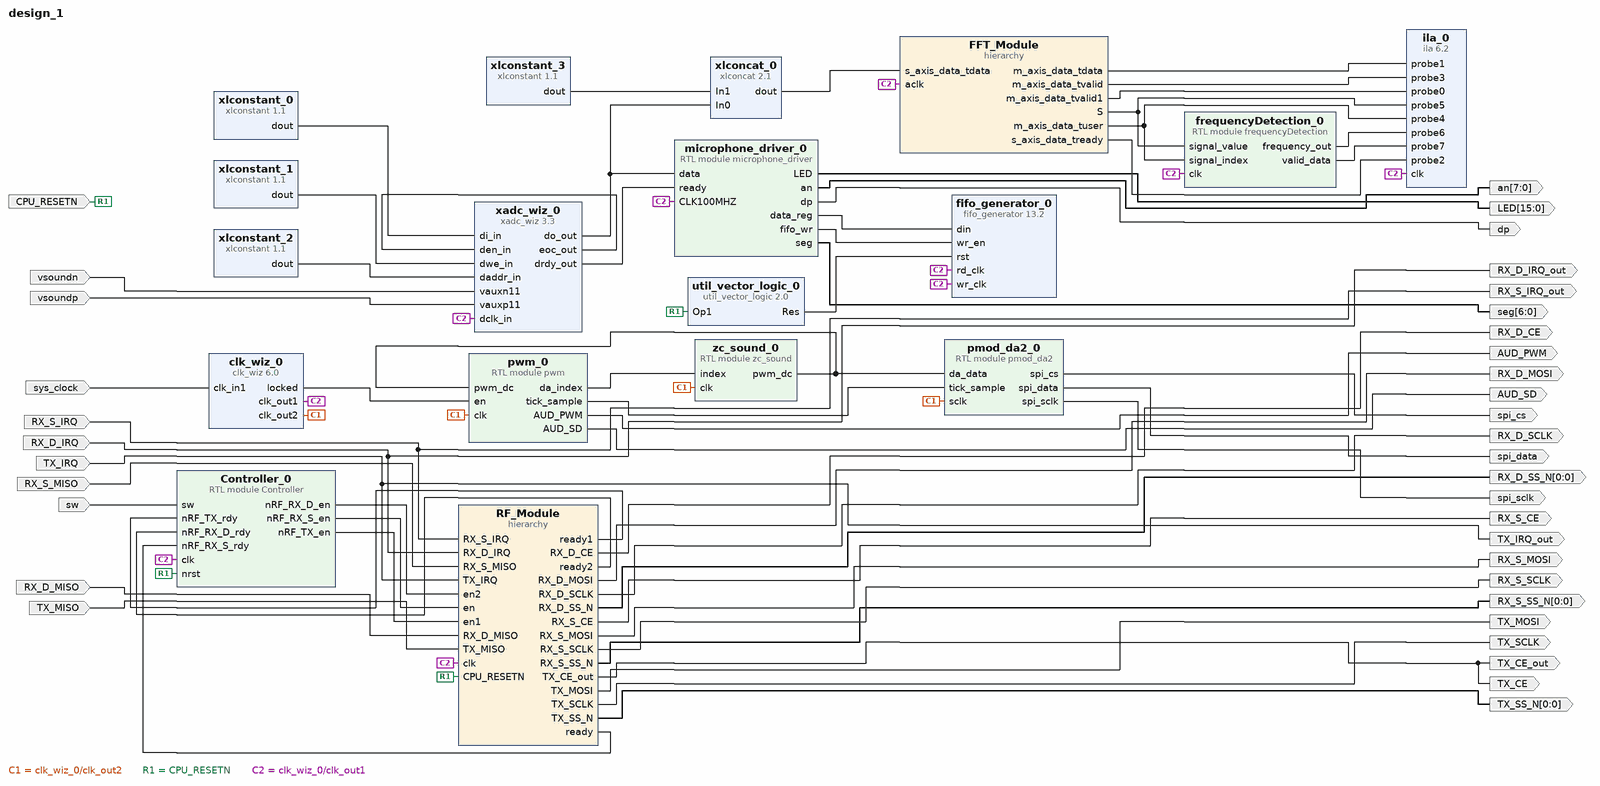
[diagram p0: block diagram of the top level]
# Vivado block design design_1, xc7a100tcsg324-1, Vivado 2022.1
create_bd_design design_1

create_bd_port -dir O TX_CE
create_bd_port -dir I TX_MISO
create_bd_port -dir O TX_MOSI
create_bd_port -dir O TX_SCLK
create_bd_port -dir O -from 0 -to 0 TX_SS_N
create_bd_port -dir I -type intr TX_IRQ
create_bd_port -dir I -type rst CPU_RESETN
create_bd_port -dir O RX_S_CE
create_bd_port -dir I -type intr RX_S_IRQ
create_bd_port -dir I RX_S_MISO
create_bd_port -dir O RX_S_MOSI
create_bd_port -dir O RX_S_SCLK
create_bd_port -dir O -from 0 -to 0 RX_S_SS_N
create_bd_port -dir O RX_D_CE
create_bd_port -dir I -type intr RX_D_IRQ
create_bd_port -dir I RX_D_MISO
create_bd_port -dir O RX_D_MOSI
create_bd_port -dir O RX_D_SCLK
create_bd_port -dir O -from 0 -to 0 RX_D_SS_N
create_bd_port -dir O TX_IRQ_out
create_bd_port -dir O RX_S_IRQ_out
create_bd_port -dir O RX_D_IRQ_out
create_bd_port -dir O TX_CE_out
create_bd_port -dir O AUD_SD
create_bd_port -dir O AUD_PWM
create_bd_port -dir I -type clk sys_clock
set_property -dict {CONFIG.FREQ_HZ 100000000 CONFIG.PHASE 0.000} [get_bd_ports sys_clock]
create_bd_port -dir I vsoundp
create_bd_port -dir O -from 15 -to 0 LED
create_bd_port -dir O -from 7 -to 0 an
create_bd_port -dir O dp
create_bd_port -dir O -from 6 -to 0 seg
create_bd_port -dir O spi_cs
create_bd_port -dir O spi_data
create_bd_port -dir O spi_sclk
create_bd_port -dir I sw
create_bd_port -dir I vsoundn

create_bd_cell -type ip -vlnv xilinx.com:ip:clk_wiz:6.0 clk_wiz_0
set_property -dict [list \
  CONFIG.CLKOUT1_JITTER 130.958 \
  CONFIG.CLKOUT1_PHASE_ERROR 98.575 \
  CONFIG.CLKOUT1_REQUESTED_OUT_FREQ 100.000 \
  CONFIG.CLKOUT2_JITTER 183.243 \
  CONFIG.CLKOUT2_PHASE_ERROR 98.575 \
  CONFIG.CLKOUT2_REQUESTED_OUT_FREQ 20.000 \
  CONFIG.CLKOUT2_USED true \
  CONFIG.CLKOUT3_JITTER 130.958 \
  CONFIG.CLKOUT3_PHASE_ERROR 98.575 \
  CONFIG.CLKOUT3_REQUESTED_OUT_FREQ 25.000 \
  CONFIG.CLKOUT3_USED false \
  CONFIG.MMCM_CLKFBOUT_MULT_F 10.000 \
  CONFIG.MMCM_CLKOUT0_DIVIDE_F 10.000 \
  CONFIG.MMCM_CLKOUT1_DIVIDE 50 \
  CONFIG.MMCM_CLKOUT2_DIVIDE 1 \
  CONFIG.MMCM_DIVCLK_DIVIDE 1 \
  CONFIG.NUM_OUT_CLKS 2 \
  CONFIG.USE_RESET false \
] [get_bd_cells clk_wiz_0]
create_bd_cell -type ip -vlnv xilinx.com:ip:xadc_wiz:3.3 xadc_wiz_0
set_property -dict [list \
  CONFIG.ADC_CONVERSION_RATE 200 \
  CONFIG.ADC_OFFSET_AND_GAIN_CALIBRATION false \
  CONFIG.ADC_OFFSET_CALIBRATION false \
  CONFIG.CHANNEL_AVERAGING None \
  CONFIG.CHANNEL_ENABLE_VAUXP11_VAUXN11 true \
  CONFIG.CHANNEL_ENABLE_VP_VN true \
  CONFIG.CHANNEL_ENABLE_VREFP false \
  CONFIG.DCLK_FREQUENCY 100 \
  CONFIG.ENABLE_CALIBRATION_AVERAGING false \
  CONFIG.ENABLE_RESET false \
  CONFIG.EXTERNAL_MUX_CHANNEL VP_VN \
  CONFIG.INTERFACE_SELECTION ENABLE_DRP \
  CONFIG.OT_ALARM false \
  CONFIG.SENSOR_OFFSET_AND_GAIN_CALIBRATION false \
  CONFIG.SENSOR_OFFSET_CALIBRATION false \
  CONFIG.SEQUENCER_MODE Continuous \
  CONFIG.SINGLE_CHANNEL_SELECTION TEMPERATURE \
  CONFIG.USER_TEMP_ALARM false \
  CONFIG.VCCAUX_ALARM false \
  CONFIG.VCCINT_ALARM false \
  CONFIG.XADC_STARUP_SELECTION channel_sequencer \
] [get_bd_cells xadc_wiz_0]
create_bd_cell -type ip -vlnv xilinx.com:ip:xlconstant:1.1 xlconstant_0
set_property -dict {CONFIG.CONST_VAL 0 CONFIG.CONST_WIDTH 16} [get_bd_cells xlconstant_0]
create_bd_cell -type ip -vlnv xilinx.com:ip:xlconstant:1.1 xlconstant_1
set_property -dict {CONFIG.CONST_VAL 0} [get_bd_cells xlconstant_1]
create_bd_cell -type module -reference zc_sound zc_sound_0
create_bd_cell -type module -reference pwm pwm_0
create_bd_cell -type ip -vlnv xilinx.com:ip:fifo_generator:13.2 fifo_generator_0
set_property -dict [list \
  CONFIG.Fifo_Implementation Independent_Clocks_Builtin_FIFO \
  CONFIG.Input_Data_Width 12 \
  CONFIG.Input_Depth 512 \
  CONFIG.Read_Clock_Frequency 20 \
  CONFIG.Write_Clock_Frequency 100 \
] [get_bd_cells fifo_generator_0]
create_bd_cell -type ip -vlnv xilinx.com:ip:util_vector_logic:2.0 util_vector_logic_0
set_property -dict {CONFIG.C_OPERATION not CONFIG.C_SIZE 1} [get_bd_cells util_vector_logic_0]
create_bd_cell -type ip -vlnv xilinx.com:ip:xlconstant:1.1 xlconstant_2
set_property -dict {CONFIG.CONST_VAL 0x1B CONFIG.CONST_WIDTH 7} [get_bd_cells xlconstant_2]
create_bd_cell -type module -reference Controller Controller_0
create_bd_cell -type module -reference pmod_da2 pmod_da2_0
create_bd_cell -type ip -vlnv xilinx.com:ip:ila:6.2 ila_0
set_property -dict [list \
  CONFIG.C_DATA_DEPTH 8192 \
  CONFIG.C_ENABLE_ILA_AXI_MON false \
  CONFIG.C_MONITOR_TYPE Native \
  CONFIG.C_NUM_OF_PROBES 8 \
  CONFIG.C_PROBE1_TYPE 1 \
  CONFIG.C_PROBE1_WIDTH 32 \
  CONFIG.C_PROBE2_TYPE 0 \
  CONFIG.C_PROBE2_WIDTH 1 \
  CONFIG.C_PROBE3_TYPE 0 \
  CONFIG.C_PROBE3_WIDTH 1 \
  CONFIG.C_PROBE4_TYPE 1 \
  CONFIG.C_PROBE4_WIDTH 16 \
  CONFIG.C_PROBE5_TYPE 1 \
  CONFIG.C_PROBE5_WIDTH 32 \
  CONFIG.C_PROBE6_WIDTH 32 \
] [get_bd_cells ila_0]
create_bd_cell -type hier FFT_Module
create_bd_cell -type module -reference microphone_driver microphone_driver_0
create_bd_cell -type hier RF_Module
create_bd_cell -type ip -vlnv xilinx.com:ip:xlconcat:2.1 xlconcat_0
set_property -dict {CONFIG.IN0_WIDTH 16 CONFIG.IN1_WIDTH 16} [get_bd_cells xlconcat_0]
create_bd_cell -type ip -vlnv xilinx.com:ip:xlconstant:1.1 xlconstant_3
set_property -dict {CONFIG.CONST_VAL 0 CONFIG.CONST_WIDTH 16} [get_bd_cells xlconstant_3]
create_bd_cell -type module -reference frequencyDetection frequencyDetection_0

# ---- hierarchy /FFT_Module ----
current_bd_instance /FFT_Module
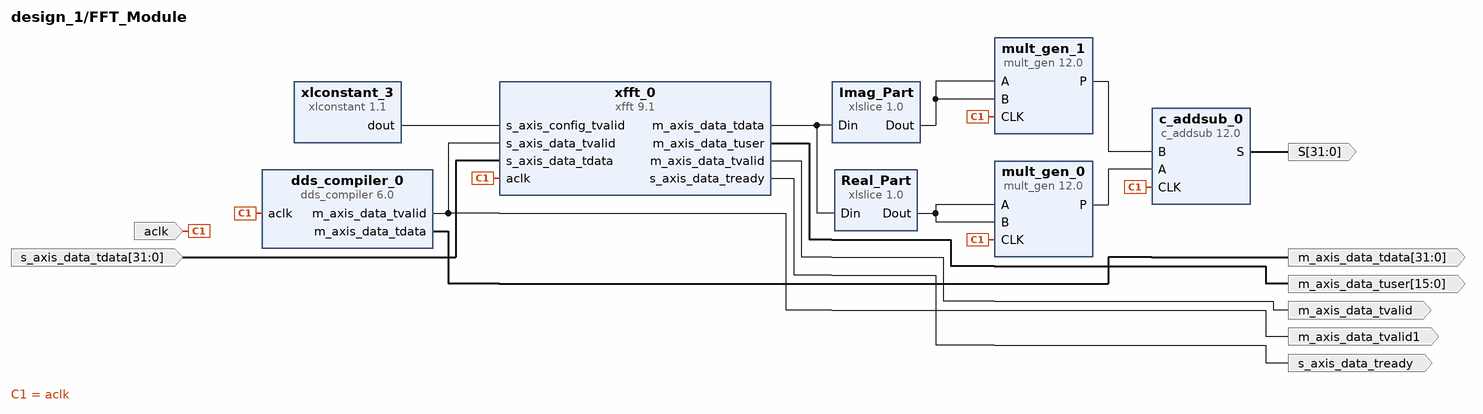
[diagram p1: block diagram inside /FFT_Module]
create_bd_pin -dir I -type clk aclk
create_bd_pin -dir O -from 15 -to 0 m_axis_data_tuser
create_bd_pin -dir O m_axis_data_tvalid
create_bd_pin -dir O -from 31 -to 0 -type data S
create_bd_pin -dir O -from 31 -to 0 m_axis_data_tdata
create_bd_pin -dir O m_axis_data_tvalid1
create_bd_pin -dir O s_axis_data_tready
create_bd_pin -dir I -from 31 -to 0 s_axis_data_tdata

create_bd_cell -type ip -vlnv xilinx.com:ip:mult_gen:12.0 mult_gen_0
set_property -dict {CONFIG.PortAWidth 16 CONFIG.PortBWidth 16 CONFIG.Use_Custom_Output_Width false} [get_bd_cells mult_gen_0]
create_bd_cell -type ip -vlnv xilinx.com:ip:xfft:9.1 xfft_0
set_property -dict [list \
  CONFIG.data_format fixed_point \
  CONFIG.implementation_options automatically_select \
  CONFIG.input_width 16 \
  CONFIG.number_of_stages_using_block_ram_for_data_and_phase_factors 0 \
  CONFIG.output_ordering natural_order \
  CONFIG.phase_factor_width 16 \
  CONFIG.scaling_options scaled \
  CONFIG.target_clock_frequency 100 \
  CONFIG.target_data_throughput 2 \
  CONFIG.transform_length 4096 \
  CONFIG.xk_index true \
] [get_bd_cells xfft_0]
create_bd_cell -type ip -vlnv xilinx.com:ip:mult_gen:12.0 mult_gen_1
set_property -dict {CONFIG.PortAWidth 16 CONFIG.PortBWidth 16 CONFIG.Use_Custom_Output_Width false} [get_bd_cells mult_gen_1]
create_bd_cell -type ip -vlnv xilinx.com:ip:xlconstant:1.1 xlconstant_3
set_property -dict {CONFIG.CONST_VAL 0} [get_bd_cells xlconstant_3]
create_bd_cell -type ip -vlnv xilinx.com:ip:c_addsub:12.0 c_addsub_0
set_property -dict [list \
  CONFIG.A_Width 32 \
  CONFIG.B_Value 00000000000000000000000000000000 \
  CONFIG.B_Width 32 \
  CONFIG.CE false \
  CONFIG.Latency 1 \
  CONFIG.Out_Width 32 \
] [get_bd_cells c_addsub_0]
create_bd_cell -type ip -vlnv xilinx.com:ip:xlslice:1.0 Imag_Part
set_property -dict {CONFIG.DIN_FROM 15 CONFIG.DOUT_WIDTH 16} [get_bd_cells Imag_Part]
create_bd_cell -type ip -vlnv xilinx.com:ip:xlslice:1.0 Real_Part
set_property -dict {CONFIG.DIN_FROM 15 CONFIG.DOUT_WIDTH 16} [get_bd_cells Real_Part]
create_bd_cell -type ip -vlnv xilinx.com:ip:dds_compiler:6.0 dds_compiler_0
set_property -dict [list \
  CONFIG.Has_Phase_Out false \
  CONFIG.Latency 7 \
  CONFIG.M_DATA_Has_TUSER Not_Required \
  CONFIG.Noise_Shaping None \
  CONFIG.Output_Frequency1 0 \
  CONFIG.Output_Width 16 \
  CONFIG.PINC1 1100110011001100110011001101 \
  CONFIG.Parameter_Entry Hardware_Parameters \
  CONFIG.Phase_Width 32 \
] [get_bd_cells dds_compiler_0]

# ---- hierarchy /RF_Module ----
current_bd_instance /RF_Module
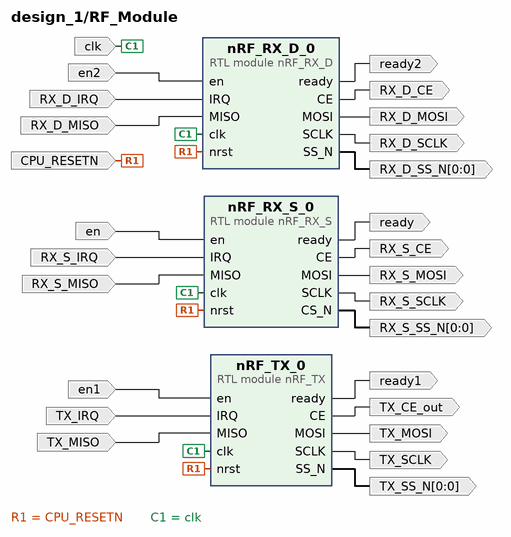
[diagram p2: block diagram inside /RF_Module]
create_bd_pin -dir I -type clk clk
create_bd_pin -dir I -type rst CPU_RESETN
create_bd_pin -dir I en
create_bd_pin -dir O ready
create_bd_pin -dir I RX_S_MISO
create_bd_pin -dir I -type intr RX_S_IRQ
create_bd_pin -dir O -from 0 -to 0 RX_S_SS_N
create_bd_pin -dir O RX_S_SCLK
create_bd_pin -dir O RX_S_MOSI
create_bd_pin -dir O RX_S_CE
create_bd_pin -dir I en1
create_bd_pin -dir O ready1
create_bd_pin -dir I TX_MISO
create_bd_pin -dir I -type intr TX_IRQ
create_bd_pin -dir O -from 0 -to 0 TX_SS_N
create_bd_pin -dir O TX_SCLK
create_bd_pin -dir O TX_MOSI
create_bd_pin -dir O TX_CE_out
create_bd_pin -dir I en2
create_bd_pin -dir O ready2
create_bd_pin -dir I RX_D_MISO
create_bd_pin -dir I -type intr RX_D_IRQ
create_bd_pin -dir O -from 0 -to 0 RX_D_SS_N
create_bd_pin -dir O RX_D_SCLK
create_bd_pin -dir O RX_D_MOSI
create_bd_pin -dir O RX_D_CE

create_bd_cell -type module -reference nRF_RX_S nRF_RX_S_0
create_bd_cell -type module -reference nRF_TX nRF_TX_0
create_bd_cell -type module -reference nRF_RX_D nRF_RX_D_0

# ---- connections ----

current_bd_instance /FFT_Module
connect_bd_net [get_bd_pins Imag_Part/Dout] [get_bd_pins mult_gen_1/A] [get_bd_pins mult_gen_1/B]
connect_bd_net [get_bd_pins Real_Part/Dout] [get_bd_pins mult_gen_0/A] [get_bd_pins mult_gen_0/B]
connect_bd_net [get_bd_pins c_addsub_0/S] [get_bd_pins S]
connect_bd_net [get_bd_pins dds_compiler_0/m_axis_data_tdata] [get_bd_pins m_axis_data_tdata]
connect_bd_net [get_bd_pins dds_compiler_0/m_axis_data_tvalid] [get_bd_pins xfft_0/s_axis_data_tvalid] [get_bd_pins m_axis_data_tvalid1]
connect_bd_net [get_bd_pins mult_gen_0/P] [get_bd_pins c_addsub_0/A]
connect_bd_net [get_bd_pins mult_gen_1/P] [get_bd_pins c_addsub_0/B]
connect_bd_net [get_bd_pins s_axis_data_tdata] [get_bd_pins xfft_0/s_axis_data_tdata]
connect_bd_net -net sys_clock [get_bd_pins aclk] \
  [get_bd_pins xfft_0/aclk] [get_bd_pins dds_compiler_0/aclk] [get_bd_pins mult_gen_1/CLK] [get_bd_pins c_addsub_0/CLK] \
  [get_bd_pins mult_gen_0/CLK]
connect_bd_net [get_bd_pins xfft_0/m_axis_data_tdata] [get_bd_pins Real_Part/Din] [get_bd_pins Imag_Part/Din]
connect_bd_net [get_bd_pins xfft_0/m_axis_data_tuser] [get_bd_pins m_axis_data_tuser]
connect_bd_net [get_bd_pins xfft_0/m_axis_data_tvalid] [get_bd_pins m_axis_data_tvalid]
connect_bd_net [get_bd_pins xfft_0/s_axis_data_tready] [get_bd_pins s_axis_data_tready]
connect_bd_net [get_bd_pins xlconstant_3/dout] [get_bd_pins xfft_0/s_axis_config_tvalid]

current_bd_instance /RF_Module
connect_bd_net -net Controller_0_nRF_RX_D_en [get_bd_pins en2] [get_bd_pins nRF_RX_D_0/en]
connect_bd_net -net Controller_0_nRF_RX_S_en [get_bd_pins en] [get_bd_pins nRF_RX_S_0/en]
connect_bd_net -net Controller_0_nRF_TX_en [get_bd_pins en1] [get_bd_pins nRF_TX_0/en]
connect_bd_net -net IRQ_0_1 [get_bd_pins RX_S_IRQ] [get_bd_pins nRF_RX_S_0/IRQ]
connect_bd_net -net IRQ_0_2 [get_bd_pins RX_D_IRQ] [get_bd_pins nRF_RX_D_0/IRQ]
connect_bd_net -net IRQ_1 [get_bd_pins TX_IRQ] [get_bd_pins nRF_TX_0/IRQ]
connect_bd_net -net MISO_0_1 [get_bd_pins RX_S_MISO] [get_bd_pins nRF_RX_S_0/MISO]
connect_bd_net -net MISO_0_2 [get_bd_pins RX_D_MISO] [get_bd_pins nRF_RX_D_0/MISO]
connect_bd_net -net MISO_1 [get_bd_pins TX_MISO] [get_bd_pins nRF_TX_0/MISO]
connect_bd_net -net SPI_Driver_0_ready [get_bd_pins nRF_TX_0/ready] [get_bd_pins ready1]
connect_bd_net [get_bd_pins nRF_RX_D_0/CE] [get_bd_pins RX_D_CE]
connect_bd_net [get_bd_pins nRF_RX_D_0/MOSI] [get_bd_pins RX_D_MOSI]
connect_bd_net [get_bd_pins nRF_RX_D_0/SCLK] [get_bd_pins RX_D_SCLK]
connect_bd_net [get_bd_pins nRF_RX_D_0/SS_N] [get_bd_pins RX_D_SS_N]
connect_bd_net [get_bd_pins nRF_RX_D_0/ready] [get_bd_pins ready2]
connect_bd_net [get_bd_pins nRF_RX_S_0/CE] [get_bd_pins RX_S_CE]
connect_bd_net [get_bd_pins nRF_RX_S_0/MOSI] [get_bd_pins RX_S_MOSI]
connect_bd_net [get_bd_pins nRF_RX_S_0/SCLK] [get_bd_pins RX_S_SCLK]
connect_bd_net -net nRF_RX_S_0_SS_N [get_bd_pins nRF_RX_S_0/CS_N] [get_bd_pins RX_S_SS_N]
connect_bd_net [get_bd_pins nRF_RX_S_0/ready] [get_bd_pins ready]
connect_bd_net [get_bd_pins nRF_TX_0/CE] [get_bd_pins TX_CE_out]
connect_bd_net [get_bd_pins nRF_TX_0/MOSI] [get_bd_pins TX_MOSI]
connect_bd_net [get_bd_pins nRF_TX_0/SCLK] [get_bd_pins TX_SCLK]
connect_bd_net [get_bd_pins nRF_TX_0/SS_N] [get_bd_pins TX_SS_N]
connect_bd_net -net rst_0_1 [get_bd_pins CPU_RESETN] [get_bd_pins nRF_TX_0/nrst] [get_bd_pins nRF_RX_D_0/nrst] [get_bd_pins nRF_RX_S_0/nrst]
connect_bd_net -net sys_clock [get_bd_pins clk] [get_bd_pins nRF_TX_0/clk] [get_bd_pins nRF_RX_D_0/clk] [get_bd_pins nRF_RX_S_0/clk]

current_bd_instance /
connect_bd_net [get_bd_pins Controller_0/nRF_RX_D_en] [get_bd_pins RF_Module/en2]
connect_bd_net [get_bd_pins Controller_0/nRF_RX_S_en] [get_bd_pins RF_Module/en]
connect_bd_net [get_bd_pins Controller_0/nRF_TX_en] [get_bd_pins RF_Module/en1]
connect_bd_net [get_bd_pins FFT_Module/S] [get_bd_pins ila_0/probe5] [get_bd_pins frequencyDetection_0/signal_value]
connect_bd_net [get_bd_pins FFT_Module/m_axis_data_tdata] [get_bd_pins ila_0/probe1]
connect_bd_net [get_bd_pins FFT_Module/m_axis_data_tuser] [get_bd_pins ila_0/probe4] [get_bd_pins frequencyDetection_0/signal_index]
connect_bd_net [get_bd_pins FFT_Module/m_axis_data_tvalid] [get_bd_pins ila_0/probe3]
connect_bd_net [get_bd_pins FFT_Module/m_axis_data_tvalid1] [get_bd_pins ila_0/probe0]
connect_bd_net [get_bd_pins FFT_Module/s_axis_data_tready] [get_bd_pins ila_0/probe2]
connect_bd_net -net IRQ_0_1 [get_bd_ports RX_S_IRQ] [get_bd_ports RX_S_IRQ_out] [get_bd_pins RF_Module/RX_S_IRQ]
connect_bd_net -net IRQ_0_2 [get_bd_ports RX_D_IRQ] [get_bd_ports RX_D_IRQ_out] [get_bd_pins RF_Module/RX_D_IRQ]
connect_bd_net -net IRQ_1 [get_bd_ports TX_IRQ] [get_bd_ports TX_IRQ_out] [get_bd_pins RF_Module/TX_IRQ]
connect_bd_net -net MISO_0_1 [get_bd_ports RX_S_MISO] [get_bd_pins RF_Module/RX_S_MISO]
connect_bd_net -net MISO_0_2 [get_bd_ports RX_D_MISO] [get_bd_pins RF_Module/RX_D_MISO]
connect_bd_net -net MISO_1 [get_bd_ports TX_MISO] [get_bd_pins RF_Module/TX_MISO]
connect_bd_net -net SPI_Driver_0_ready [get_bd_pins RF_Module/ready1] [get_bd_pins Controller_0/nRF_TX_rdy]
connect_bd_net [get_bd_pins clk_wiz_0/clk_out2] [get_bd_pins zc_sound_0/clk] [get_bd_pins pwm_0/clk] [get_bd_pins pmod_da2_0/sclk]
connect_bd_net [get_bd_pins clk_wiz_0/locked] [get_bd_pins pwm_0/en]
connect_bd_net -net frequencyDetection_0_frequence_out [get_bd_pins frequencyDetection_0/frequency_out] [get_bd_pins ila_0/probe6]
connect_bd_net [get_bd_pins frequencyDetection_0/valid_data] [get_bd_pins ila_0/probe7]
connect_bd_net [get_bd_pins microphone_driver_0/LED] [get_bd_ports LED]
connect_bd_net [get_bd_pins microphone_driver_0/an] [get_bd_ports an]
connect_bd_net [get_bd_pins microphone_driver_0/data_reg] [get_bd_pins fifo_generator_0/din]
connect_bd_net [get_bd_pins microphone_driver_0/dp] [get_bd_ports dp]
connect_bd_net [get_bd_pins microphone_driver_0/fifo_wr] [get_bd_pins fifo_generator_0/wr_en]
connect_bd_net [get_bd_pins microphone_driver_0/seg] [get_bd_ports seg]
connect_bd_net -net nRF_RX_D_0_CE [get_bd_pins RF_Module/RX_D_CE] [get_bd_ports RX_D_CE]
connect_bd_net -net nRF_RX_D_0_MOSI [get_bd_pins RF_Module/RX_D_MOSI] [get_bd_ports RX_D_MOSI]
connect_bd_net -net nRF_RX_D_0_SCLK [get_bd_pins RF_Module/RX_D_SCLK] [get_bd_ports RX_D_SCLK]
connect_bd_net -net nRF_RX_D_0_SS_N [get_bd_pins RF_Module/RX_D_SS_N] [get_bd_ports RX_D_SS_N]
connect_bd_net -net nRF_RX_D_0_ready [get_bd_pins RF_Module/ready2] [get_bd_pins Controller_0/nRF_RX_D_rdy]
connect_bd_net -net nRF_RX_S_0_CE [get_bd_pins RF_Module/RX_S_CE] [get_bd_ports RX_S_CE]
connect_bd_net -net nRF_RX_S_0_MOSI [get_bd_pins RF_Module/RX_S_MOSI] [get_bd_ports RX_S_MOSI]
connect_bd_net -net nRF_RX_S_0_SCLK [get_bd_pins RF_Module/RX_S_SCLK] [get_bd_ports RX_S_SCLK]
connect_bd_net -net nRF_RX_S_0_SS_N [get_bd_pins RF_Module/RX_S_SS_N] [get_bd_ports RX_S_SS_N]
connect_bd_net -net nRF_RX_S_0_ready [get_bd_pins RF_Module/ready] [get_bd_pins Controller_0/nRF_RX_S_rdy]
connect_bd_net -net nRF_TX_0_CE [get_bd_pins RF_Module/TX_CE_out] [get_bd_ports TX_CE] [get_bd_ports TX_CE_out]
connect_bd_net -net nRF_TX_0_MOSI [get_bd_pins RF_Module/TX_MOSI] [get_bd_ports TX_MOSI]
connect_bd_net -net nRF_TX_0_SCLK [get_bd_pins RF_Module/TX_SCLK] [get_bd_ports TX_SCLK]
connect_bd_net -net nRF_TX_0_SS_N [get_bd_pins RF_Module/TX_SS_N] [get_bd_ports TX_SS_N]
connect_bd_net [get_bd_pins pmod_da2_0/spi_cs] [get_bd_ports spi_cs]
connect_bd_net [get_bd_pins pmod_da2_0/spi_data] [get_bd_ports spi_data]
connect_bd_net [get_bd_pins pmod_da2_0/spi_sclk] [get_bd_ports spi_sclk]
connect_bd_net [get_bd_pins pwm_0/AUD_PWM] [get_bd_ports AUD_PWM]
connect_bd_net [get_bd_pins pwm_0/AUD_SD] [get_bd_ports AUD_SD]
connect_bd_net -net pwm_0_index [get_bd_pins pwm_0/da_index] [get_bd_pins zc_sound_0/index]
connect_bd_net [get_bd_pins pwm_0/tick_sample] [get_bd_pins pmod_da2_0/tick_sample]
connect_bd_net -net rst_0_1 [get_bd_ports CPU_RESETN] \
  [get_bd_pins util_vector_logic_0/Op1] [get_bd_pins Controller_0/nrst] [get_bd_pins RF_Module/CPU_RESETN]
connect_bd_net -net sw_0_1 [get_bd_ports sw] [get_bd_pins Controller_0/sw]
connect_bd_net -net sys_clock [get_bd_pins clk_wiz_0/clk_out1] \
  [get_bd_pins xadc_wiz_0/dclk_in] [get_bd_pins Controller_0/clk] [get_bd_pins fifo_generator_0/wr_clk] \
  [get_bd_pins fifo_generator_0/rd_clk] [get_bd_pins ila_0/clk] [get_bd_pins FFT_Module/aclk] \
  [get_bd_pins microphone_driver_0/CLK100MHZ] [get_bd_pins RF_Module/clk] [get_bd_pins frequencyDetection_0/clk]
connect_bd_net [get_bd_ports sys_clock] [get_bd_pins clk_wiz_0/clk_in1]
connect_bd_net [get_bd_pins util_vector_logic_0/Res] [get_bd_pins fifo_generator_0/rst]
connect_bd_net [get_bd_ports vsoundn] [get_bd_pins xadc_wiz_0/vauxn11]
connect_bd_net [get_bd_ports vsoundp] [get_bd_pins xadc_wiz_0/vauxp11]
connect_bd_net [get_bd_pins xadc_wiz_0/do_out] [get_bd_pins microphone_driver_0/data] [get_bd_pins xlconcat_0/In0]
connect_bd_net [get_bd_pins xadc_wiz_0/drdy_out] [get_bd_pins microphone_driver_0/ready]
connect_bd_net [get_bd_pins xadc_wiz_0/eoc_out] [get_bd_pins xadc_wiz_0/den_in]
connect_bd_net [get_bd_pins xlconcat_0/dout] [get_bd_pins FFT_Module/s_axis_data_tdata]
connect_bd_net [get_bd_pins xlconstant_0/dout] [get_bd_pins xadc_wiz_0/di_in]
connect_bd_net [get_bd_pins xlconstant_1/dout] [get_bd_pins xadc_wiz_0/dwe_in]
connect_bd_net [get_bd_pins xlconstant_2/dout] [get_bd_pins xadc_wiz_0/daddr_in]
connect_bd_net [get_bd_pins xlconstant_3/dout] [get_bd_pins xlconcat_0/In1]
connect_bd_net [get_bd_pins zc_sound_0/pwm_dc] [get_bd_pins pwm_0/pwm_dc] [get_bd_pins pmod_da2_0/da_data]

validate_bd_design
save_bd_design
